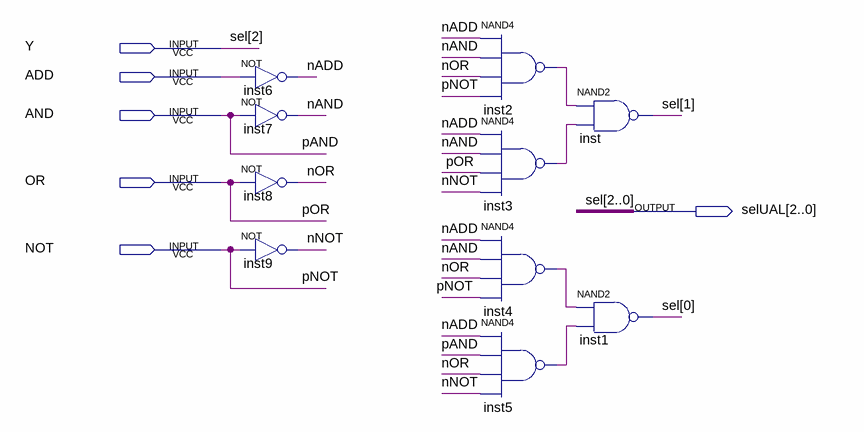
[diagram p0: schematic sheet]
// Quartus schematic CodificadorULA.bdf as structural Verilog: 10 symbols, 6 pins
module CodificadorULA (
  input  Y,
  input  ADD,
  input  AND,
  input  OR,
  input  NOT,
  output [2:0] selUAL
);

  wire inst2_out, inst3_out, inst4_out, inst5_out, nADD, nAND, nNOT, nOR;

  not inst6 (nADD, ADD);
  not inst7 (nAND, AND);
  not inst8 (nOR, OR);
  not inst9 (nNOT, NOT);
  nand inst2 (inst2_out, nADD, nAND, nOR, NOT);
  nand inst3 (inst3_out, nADD, nAND, OR, nNOT);
  nand inst4 (inst4_out, nADD, nAND, nOR, NOT);
  nand inst5 (inst5_out, nADD, AND, nOR, nNOT);
  nand inst (selUAL[1], inst2_out, inst3_out);
  nand inst1 (selUAL[0], inst4_out, inst5_out);

  assign selUAL[2] = Y;

  // Other names for the same wires on the sheet: pAND = AND; pNOT = NOT; pOR = OR; sel[2:0] = {Y, selUAL[1:0]}
endmodule
